# Altium project PCB_Project1.PrjPCB
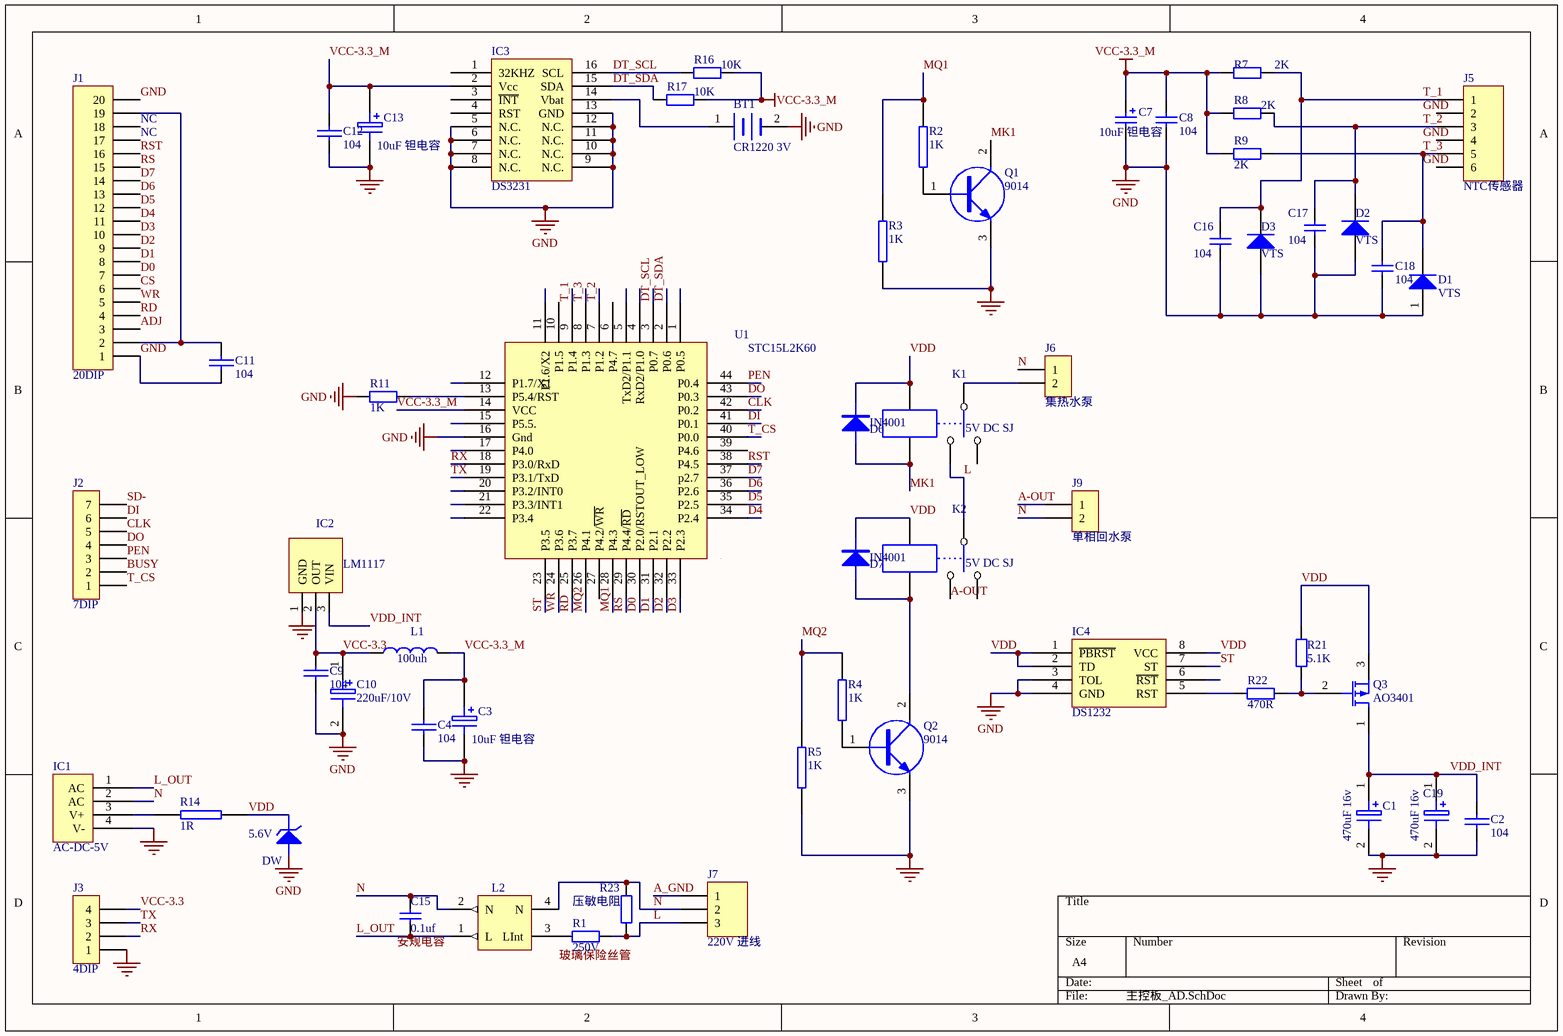
[diagram p0: 主控板_AD.SchDoc]
1 sheet, 57 parts. Net scope: global (net labels, ports and power ports of the same name join across sheets).
Board file: PCB2.PcbDoc

## Sheet 主控板_AD.SchDoc
size A4

### Parts
BT1  CR1220 3V  [bat]
C1  470uF 16v  [RB.2/.4]
C2  104  [0805]
C3  10uF 钽电容  [1206]
C4  104  [0805]
C7  10uF 钽电容  [1206]
C8  104  [0805]
C9  104  [0805]
C10  220uF/10V  [RB.2/.4]
C11  104  [0805]
C12  104  [0805]
C13  10uF 钽电容  [1206]
C15  0.1uf  [DIP_10M]
C16  104  [0805]
C17  104  [0805]
C18  104  [0805]
C19  470uF 16v  [RB.2/.4]
D1  VTS  [M7]
D2  VTS  [M7]
D3  VTS  [M7]
D6  IN4001  [IN4001]
D7  IN4001  [IN4001]
DW  5.6V  [IN4001]
IC1  AC-DC-5V  [AC_DC_5V]
IC2  LM1117  [LM1117]
IC3  DS3231  [SOP16]
IC4  DS1232  [DS1302-150MIL]
J1  20DIP  [SIP20]
J2  7DIP  [SIP7]
J3  4DIP  [SIP4]
J5  NTC传感器  [PCB_2.54_6]
J6  集热水泵  [PCB_7.62*2]
J7  220V 进线  [PCB_7.62*3]
J9  单相回水泵  [PCB_7.62*2]
K1  5V DC SJ  [继电器1-2]
K2  5V DC SJ  [继电器1-2]
L1  100uh  [0805]
L2  (no value)  [UU9.8共模]
Q1  9014  [9014A1]
Q2  9014  [9014A1]
Q3  AO3401  [9014A1]
R1  250V  [DIP_14mm]
R2  1K  [0805]
R3  1K  [0805]
R4  1K  [0805TLJW]
R5  1K  [0805TLJW]
R7  2K  [0805TLJW]
R8  2K  [0805]
R9  2K  [0805]
R11  1K  [0805]
R14  1R  [0805]
R16  10K  [0805]
R17  10K  [0805]
R21  5.1K  [0805]
R22  470R  [0805]
R23  压敏电阻  [AXIAL-0.4]
U1  STC15L2K60  [LQFP44]

### Nets
GND: BT1.2(-) C1.2 C2.2 C3.2 C4.2 C7.2 C8.2 C9.2 C10.2 C11.2 C12.2 C13.2 C16.2 C17.2 C18.1 C18.2 C19.2 D1.1(A) D1.2(K) D2.1(A) D3.1(A) DW.1(A) IC1.4(V-) IC2.1(GND) IC3.5(N.C.) IC3.6(N.C.) IC3.7(N.C.) IC3.8(N.C.) IC3.9(N.C.) IC3.10(N.C.) IC3.11(N.C.) IC3.12(N.C.) IC3.13(GND) IC4.3(TOL) IC4.4(GND) J1.1 J1.20 J3.1 J5.5 Q1.3(E) Q2.3(E) R3.2 R5.2 R9.2 R11.1 U1.8(P1.3) U1.16(Gnd)  [also labelled T_3]
VCC-3.3_M: C3.1 C4.1 C7.1 C8.1 C12.1 C13.1 IC3.2(Vcc) L1.2 R7.1 R8.1 R9.1 R16.2 R17.2 U1.14(VCC)
A-OUT: J9.1 K2.3
A_GND: J7.1
ADJ: J1.3
BUSY: J2.2
CLK: J2.5 U1.42(P0.2)
CS: J1.6
D0: J1.7 U1.30(P2.0/RSTOUT_LOW)
D1: J1.8 U1.31(P2.1)
D2: J1.9 U1.32(P2.2)
D3: J1.10 U1.33(P2.3)
D4: J1.11 U1.34(P2.4)
D5: J1.12 U1.35(P2.5)
D6: J1.13 U1.36(P2.6)
D7: J1.14 U1.37(p2.7)
DI: J2.6 U1.41(P0.1)
DO: J2.4 U1.43(P0.3)
DT_SCL: IC3.16(SCL) R16.1 U1.3(P0.7)
DT_SDA: IC3.15(SDA) R17.1 U1.2(P0.6)
L: J7.3 K1.3 K2.1 R1.2 R23.1
L_OUT: C15.1 IC1.1(AC) L2.1(L)
MK1: D6.1(A) K1.5 Q1.2(C)
MQ1: R2.2 R3.1 U1.28(P4.3)
MQ2: R4.2 R5.1 U1.26(P4.1)
N: C15.2 IC1.2(AC) J6.1 J7.2 J9.2 L2.2(N) L2.4(N) R23.2
PEN: J2.3 U1.44(P0.4)
RD: J1.4 U1.25(P3.7)
RS: J1.15 U1.29(P4.4/~{RD})
RST: J1.16 U1.38(P4.5)
RX: J3.2 U1.18(P3.0/RxD)
SD-: J2.7
ST: IC4.7(ST) U1.23(P3.5)
T_1: C16.1 D3.2(K) J5.1 R7.2 U1.9(P1.4)
T_2: C17.1 D2.2(K) J5.3 R8.2 U1.7(P1.2)
T_CS: J2.1 U1.40(P0.0)
TX: J3.3 U1.19(P3.1/TxD)
VCC-3.3: C9.1 C10.1 IC2.2(OUT) J3.4 L1.1
VDD: D6.2(K) D7.2(K) DW.2(K) IC4.1(~{PBRST}) IC4.2(TD) IC4.8(VCC) K1.4 K2.4 Q3.3(S) R14.2 R21.2
VDD_INT: C1.1 C2.1 C19.1 IC2.3(VIN) Q3.1(D)
WR: J1.5 U1.24(P3.6)
NetBT1_1: BT1.1(+) IC3.14(Vbat)
NetC11_1: C11.1 J1.2 J1.19
NetD7_1: D7.1(A) K2.5 Q2.2(C)
NetIC1_3: IC1.3(V+) R14.1
NetIC4_5: IC4.5(RST) R22.1
NetJ6_2: J6.2 K1.1
NetL2_3: L2.3(LInt) R1.1
NetQ1_1: Q1.1(B) R2.1
NetQ2_1: Q2.1(B) R4.1
NetQ3_2: Q3.2(G) R21.1 R22.2
NetR11_2: R11.2 U1.13(P5.4/RST)

Not connected (* = marked no-connect by the designer): IC3 1(32KHZ) 3(~{INT}) 4(RST); IC4 6(~{RST}); J1 17 18; J5 2 4 6; K1 2; K2 2; U1 1(P0.5) 4(RxD2/P1.0) 5(TxD2/P1.1) 6(P4.7) 10(P1.5) 11(P1.6/X2) 12(P1.7/X1) 15(P5.5.) 17(P4.0) 20(P3.2/INT0) 21(P3.3/INT1) 22(P3.4) 27(P4.2/~{WR}) 39(P4.6)

### Notes on the sheet
- (near J1) NC
- (near C15) 安规电容
- (near R1) 玻璃保险丝管
- Labels drawn without touching a wire or pin: GND

### Library data of the parts
BT1 = BATTERY
C1 C3 C10 C13 C19 = EC
C2 C4 C9 C11 C12 = CAP
C7 = Cap Pol2: Polarized Capacitor (Axial); Value: 100pF; Published: 8-Jun-2000; LatestRevisionDate: 17-Jul-2002; LatestRevisionNote: Re-released for DXP Platform.; PackageReference: POLAR0.8; Publisher: Altium Limited
C8 = Cap: Capacitor; Published: 8-Jun-2000; LatestRevisionDate: 17-Jul-2002; LatestRevisionNote: Re-released for DXP Platform.; PackageReference: RAD-0.3; Publisher: Altium Limited; Value: 104
C15-C18 = Cap: Capacitor; Value: 100pF; Published: 8-Jun-2000; LatestRevisionDate: 17-Jul-2002; LatestRevisionNote: Re-released for DXP Platform.; PackageReference: RAD-0.3; Publisher: Altium Limited
D1-D3 = Diode: Default Diode; Published: 8-Jun-2000; LatestRevisionDate: 17-Jul-2002; LatestRevisionNote: Re-released for DXP Platform.; PackageVersion: Sep-1996; PackageReference: SMC; Publisher: Altium Limited; Code_JEDEC: DO-214-AB
D6 D7 = D
DW = DW
J1 = CON20: Connector
J2 = CON7: Connector
J3 = CON4: Connector
J5 = Header 6: Header, 6-Pin; LatestRevisionDate: 17-Jul-2002; LatestRevisionNote: Re-released for DXP Platform.; Publisher: Altium Limited
J6 J9 = CON2: Connector
J7 = Header 3: Header, 3-Pin; LatestRevisionDate: 17-Jul-2002; LatestRevisionNote: Re-released for DXP Platform.; Publisher: Altium Limited
K1 K2 = RELAY-SPDT
L1 = B4
L2 = diangan
Q1 Q2 = NPN: NPN Transistor
Q3 = MOSFET-P: P-Channel MOSFET; Published: 8-Jun-2000; LatestRevisionDate: 17-Jul-2002; LatestRevisionNote: Re-released for DXP Platform.; PackageVersion: 1995/1996; PackageReference: E3; Publisher: Altium Limited
R1 R16 R17 R21-R23 = Res2: Resistor; Value: 1K; Published: 8-Jun-2000; LatestRevisionDate: 17-Jul-2002; LatestRevisionNote: Re-released for DXP Platform.; PackageReference: AXIAL-0.4; Publisher: Altium Limited
R2-R5 R14 = RES2
R7-R9 R11 = Res2: Resistor; Published: 8-Jun-2000; LatestRevisionDate: 17-Jul-2002; LatestRevisionNote: Re-released for DXP Platform.; PackageReference: AXIAL-0.4; Publisher: Altium Limited
  R7-R9: Value: 2K
  R11: Value: 1K
U1 = STC15L2K60: STC15L,44pin